# Altium schematic sheet Sensor_Schematic.SchDoc
size A; SheetNumber: 4; SheetTotal: 5
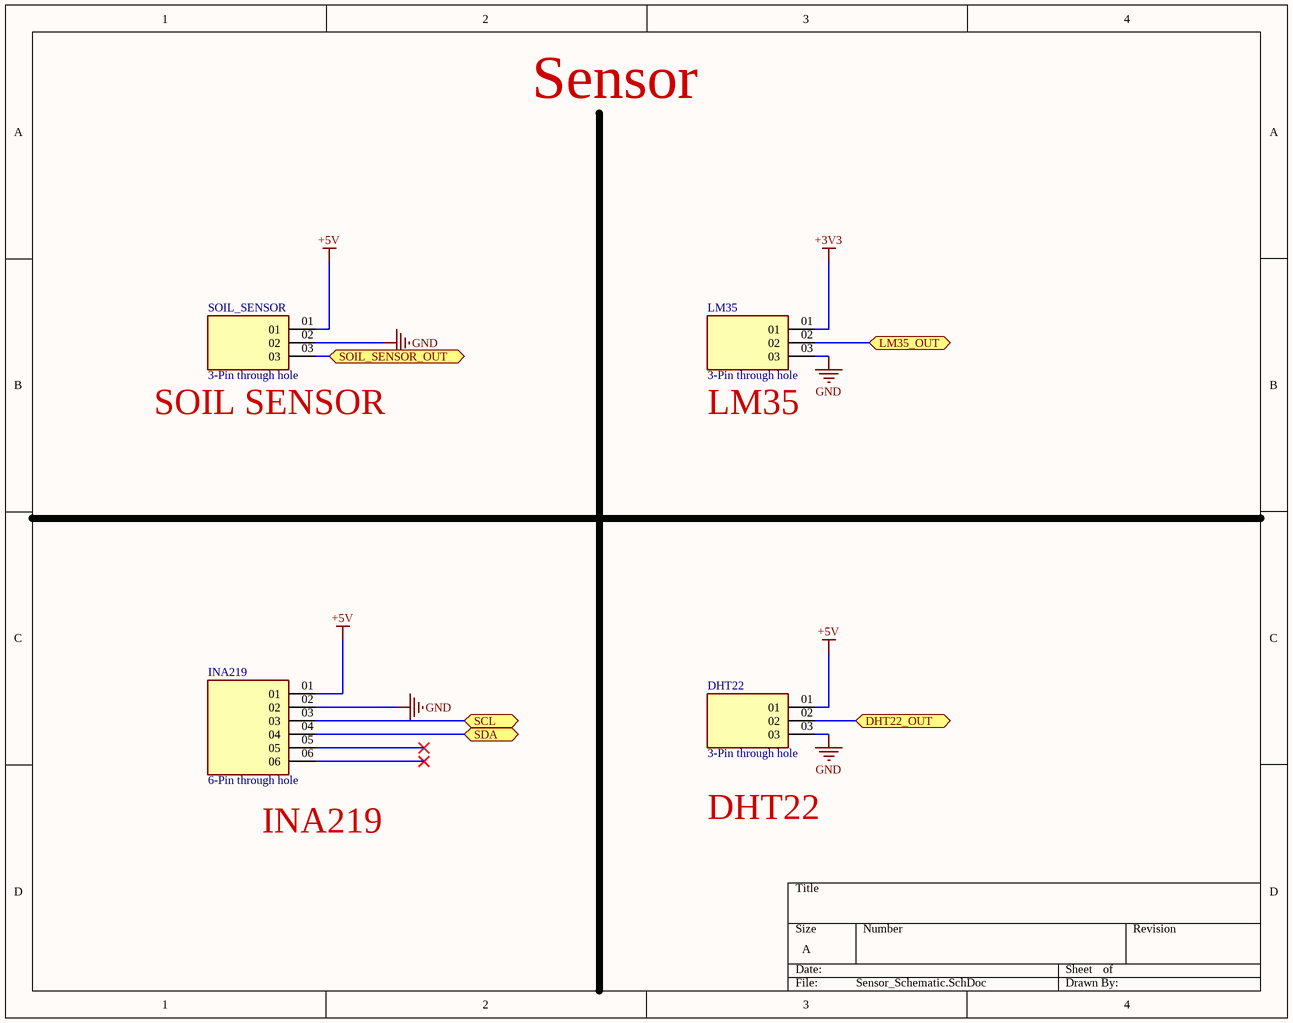
[diagram p0: Sensor_Schematic.SchDoc]

## Parts
DHT22  3-Pin through hole  [SAMTEC_MTSW-101-08-G-T-240]
INA219  6-Pin through hole  [SAMTEC_MTSW-106-22-G-S-235 - duplicate1]
LM35  3-Pin through hole  [SAMTEC_MTSW-101-08-G-T-240]
SOIL_SENSOR  3-Pin through hole  [SAMTEC_MTSW-101-08-G-T-240]

## Ports
DHT22_OUT (bidir), LM35_OUT (bidir), SCL (bidir), SDA (bidir), SOIL_SENSOR_OUT (bidir)

## Nets
+3V3: LM35.01
+5V: DHT22.01 INA219.01 SOIL_SENSOR.01
GND: DHT22.03 INA219.02 LM35.03 SOIL_SENSOR.02
DHT22_OUT: DHT22.02 ; port DHT22_OUT
LM35_OUT: LM35.02 ; port LM35_OUT
SCL: INA219.03 ; port SCL
SDA: INA219.04 ; port SDA
SOIL_SENSOR_OUT: SOIL_SENSOR.03 ; port SOIL_SENSOR_OUT

Not connected (* = marked no-connect by the designer): INA219 05* 06*

## Notes on the sheet
- Sensor
- (near SOIL_SENSOR) SOIL SENSOR
- (near LM35) LM35
- (near INA219) INA219
- DHT22

## Library data of the parts
DHT22 LM35 SOIL_SENSOR = 3-Pin through hole: MP: altium_native_batch; Package: None; Price: None; Value: *; Availability: Unavailable
INA219 = 6-Pin through hole: MP: MTSW-106-22-G-S-235; Price: None; Package: None; Availability: Unavailable; Value: *